# EAGLE design type-k (EAGLE 7.3.0)
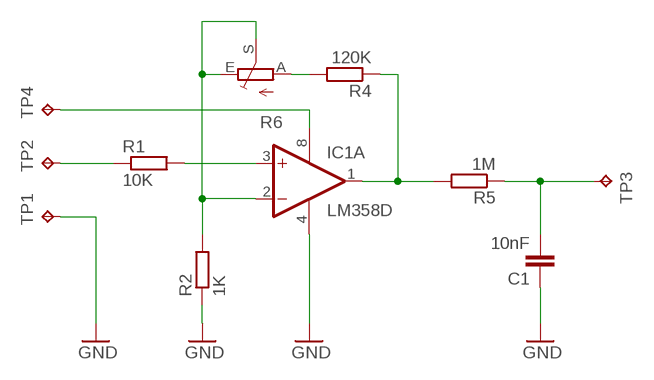
[diagram p0: schematic, sheet 1]

## Parts
C1  10nF  C-EUC0805  [C0805]
IC1  LM358D  [SO08]
R1  10K  R-EU_R0805  [R0805]
R2  1K  R-EU_R0805  [R0805]
R4  120K  R-EU_R0805  [R0805]
R5  1M  R-EU_R0805  [R0805]
R6  TRIM_EU-CA6V  [CA6V]
TP1  TPB2,54  [B2,54]
TP2  TPB2,54  [B2,54]
TP3  TPB2,54  [B2,54]
TP4  TPB2,54  [B2,54]

## Nets
GND: C1.1 IC1.4(P:V-) R2.1 TP1.TP
N$1: R1.1 TP2.TP
N$2: IC1.3(A:+IN) R1.2
N$3: IC1.2(A:-IN) R2.2 R6.E R6.S
N$4: R4.2 R6.A
N$5: IC1.1(A:OUT) R4.1 R5.2
N$6: C1.2 R5.1 TP3.TP
N$7: IC1.8(P:V+) TP4.TP
Unconnected: IC1.5(B:+IN) IC1.6(B:-IN) IC1.7(B:OUT)

## Library data of the parts
C1 = rcl:C-EU: CAPACITOR, European symbol
IC1 = linear:LM358: OP AMP also LM158; LM258; LM2904 Source: http://cache.national.com/ds/LM/LM158.pdf
R1 R2 R4 R5 = rcl:R-EU_: RESISTOR, European symbol
R6 = pot:TRIM_EU-: POTENTIOMETER
TP1-TP4 = testpad:TP: Test pad

## Board
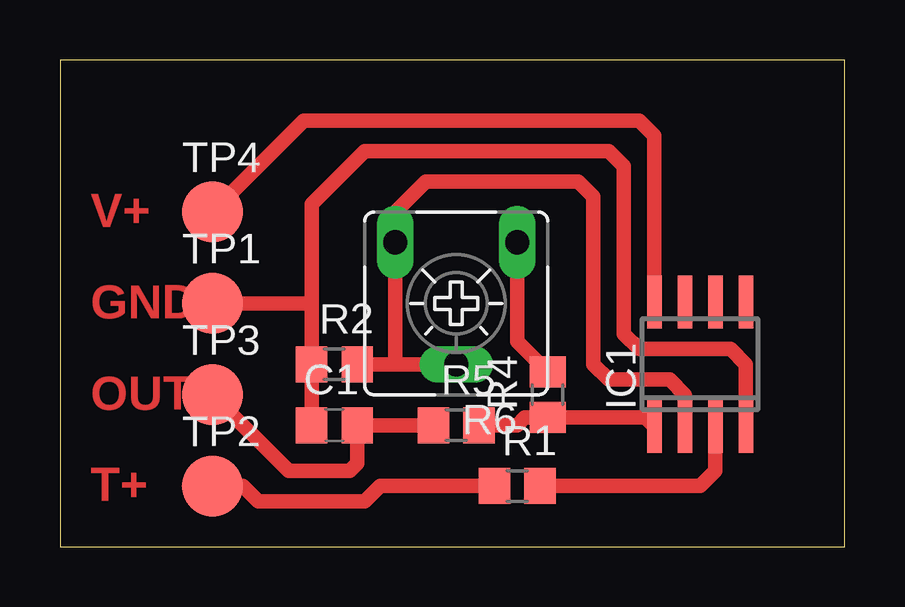
[diagram p1: board, top side]

Size 32.69 x 20.31 mm. Coordinates in mm from the lower left corner, seen from the top.
Outline: 0,0 32.69,0 32.69,20.31 0,20.31 0,0
Copper layers (1*16): Top 0.035mm / dielectric 1.5mm / Bottom 0.035mm
Design rules "default": minimum track width 10mil, minimum drill 24mil, track to track 8mil, track to pad 8mil, pad to pad 8mil, via to via 8mil, smd to smd 8mil, copper to edge 40mil, drill to drill 8mil, minimum pad ring 10mil, minimum via ring 8mil, stop-mask expansion 4mil, vias tented up to drill 0mil, thermal gap 10mil

### Footprints (pad centres in the part's own frame; a part is rotated, then mirrored left to right if it is on the bottom)
C0805 = smd 1.3 x 1.5: 1 -0.95,0; 2 0.95,0
SO08 = smd 0.6 x 2.2: 1 -1.905,-2.6; 2 -0.635,-2.6; 3 0.635,-2.6; 4 1.905,-2.6; 5 1.905,2.6; 6 0.635,2.6; 7 -0.635,2.6; 8 -1.905,2.6
R0805 = smd 1.3 x 1.5: 1 -0.95,0; 2 0.95,0
CA6V = drill 1.016 long: A -2.54,-2.54; E 2.54,-2.54; S 0,2.54
B2,54 = smd 2.54 x 2.54: TP 0,0

### Placement (x,y rotation side)
C1  11.43,5.08 0 top
IC1  26.67,7.62 0 top
R1  19.05,2.54 0 top
R2  11.43,7.62 0 top
R4  20.32,6.35 90 top
R5  16.51,5.08 0 top
R6  16.51,10.16 180 top
TP1  6.35,10.16 0 top
TP2  6.35,2.54 0 top
TP3  6.35,6.35 0 top
TP4  6.35,13.97 0 top

### Tracks (layer width: path | path; a pad name or v marks a point on that pad's centre or on a via)
GND
  Top 0.61: C1.1 R2.1 10.48,10.16 | IC1.4 28.57,7.62 27.94,8.26 24.13,8.26 23.5,8.89 23.5,15.88 22.86,16.51 12.7,16.51 10.48,14.29 10.48,10.16 | TP1.TP 10.48,10.16
N$1
  Top 0.61: R1.1 13.34,2.54 12.7,1.91 8.26,1.91 7.62,2.54 TP2.TP
N$2
  Top 0.61: R1.2 26.67,2.54 27.3,3.17 IC1.3
N$3
  Top 0.61: IC1.2 26.04,6.35 25.4,6.99 22.86,6.99 22.23,7.62 22.23,14.61 21.59,15.24 15.24,15.24 13.97,13.97 R6.E 13.97,7.62 | R2.2 13.97,7.62 | 13.97,7.62 R6.S
N$4
  Top 0.61: R6.A 19.05,8.57 R4.2
N$5
  Top 0.61: R5.2 19.05,5.08 19.37,5.4 R4.1 24.39,5.4 IC1.1
N$6
  Top 0.61: R5.1 C1.2 12.38,3.49 12.06,3.17 9.53,3.17 TP3.TP
N$7
  Top 0.61: IC1.8 24.77,17.14 24.13,17.78 10.16,17.78 TP4.TP

### Text on the board
Top: V+ | GND | OUT | T+